# Altium schematic sheet DetectorBoard_V100_DET.SchDoc
size A4; SheetNumber: 1; SheetTotal: 1; Title_: SiPM Detector
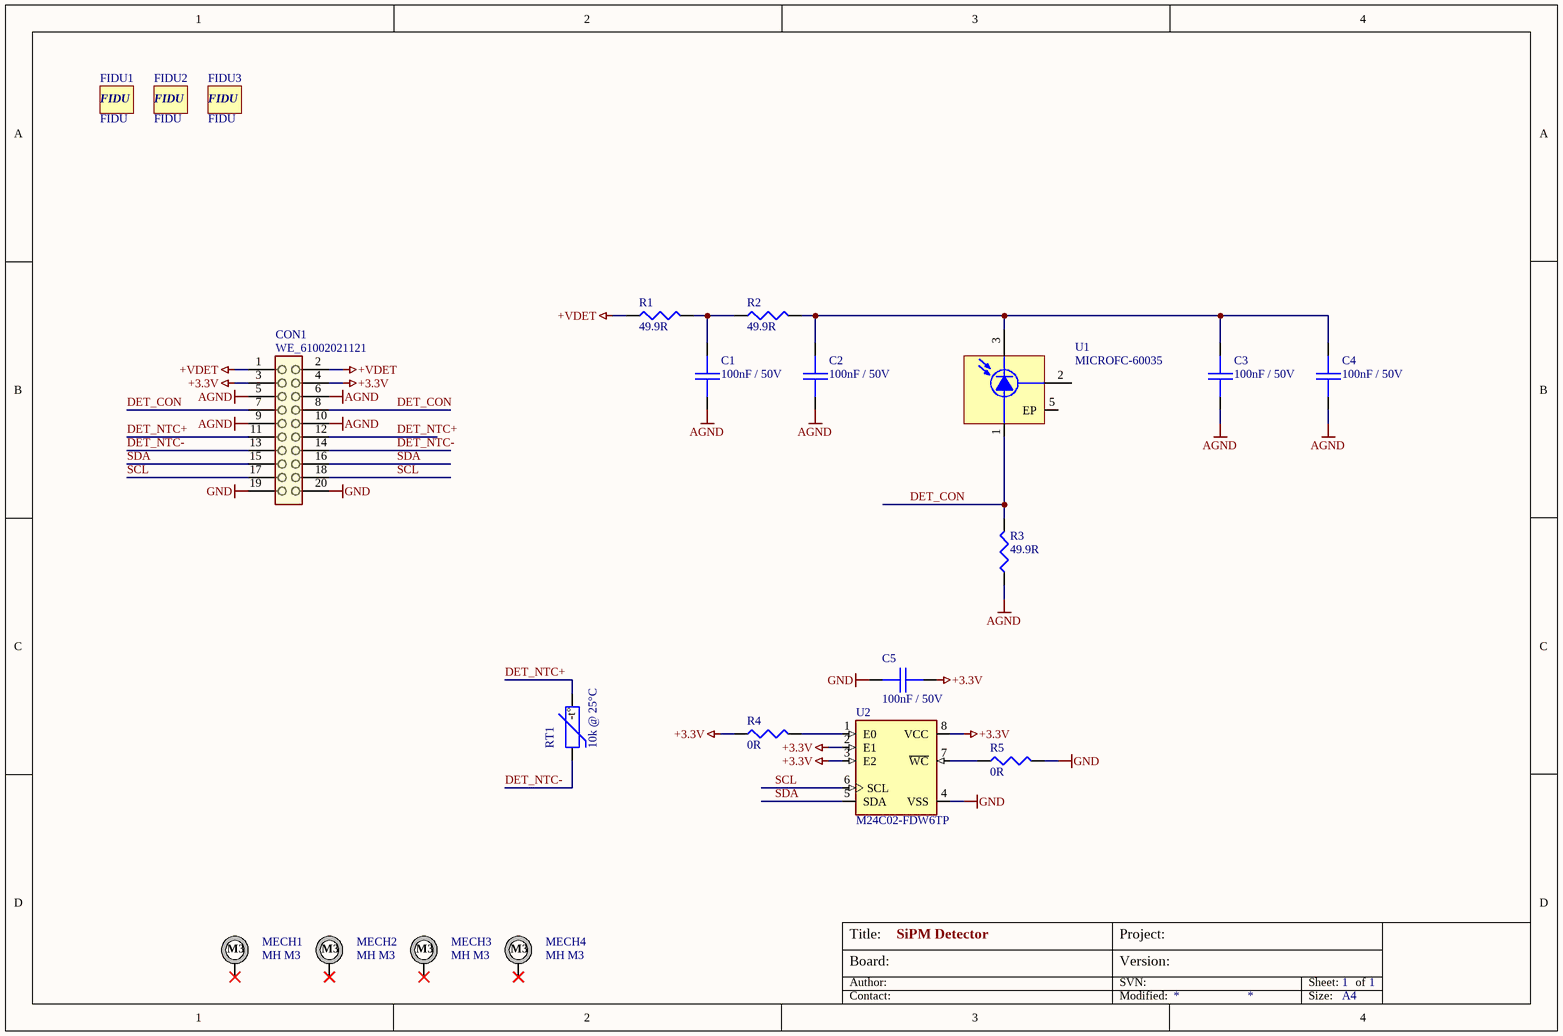
[diagram p0: DetectorBoard_V100_DET.SchDoc]

## Parts
C1  100nF / 50V  [0805_C]
C2  100nF / 50V  [0805_C]
C3  100nF / 50V  [0805_C]
C4  100nF / 50V  [0805_C]
C5  100nF / 50V  [0805_C]
CON1  WE_61002021121  [WE_61002021121]
FIDU1  FIDU  [FIDU_4x4]  (no BOM)
FIDU2  FIDU  [FIDU_4x4]  (no BOM)
FIDU3  FIDU  [FIDU_4x4]  (no BOM)
MECH1  MH M3  [PAD_M3 x 7]  (no BOM)
MECH2  MH M3  [PAD_M3 x 7]  (no BOM)
MECH3  MH M3  [PAD_M3 x 7]  (no BOM)
MECH4  MH M3  [PAD_M3 x 7]  (no BOM)
R1  49.9R  [0805]
R2  49.9R  [0805]
R3  49.9R  [0805]
R4  0R  [0805]
R5  0R  [0805]
RT1  10k @ 25°C  [0805]
U1  MICROFC-60035  [MICROFC-60035-SMT-TR]
U2  M24C02-FDW6TP  [TSSOP-8]

## Nets
+3.3V: C5.2 CON1.3 CON1.4 R4.1 U2.2(E1) U2.3(E2) U2.8(VCC)
+VDET: CON1.1 CON1.2 R1.1
AGND: C1.2 C2.2 C3.2 C4.2 CON1.5 CON1.6 CON1.9 CON1.10 R3.1
GND: C5.1 CON1.19 CON1.20 R5.2 U2.4(VSS)
DET_CON: CON1.7 CON1.8 R3.2 U1.1(P-ANODE)
DET_NTC+: CON1.11 CON1.12 RT1.2
DET_NTC-: CON1.13 CON1.14 RT1.1
SCL: CON1.17 CON1.18 U2.6(SCL)
SDA: CON1.15 CON1.16 U2.5(SDA)
NetC1_1: C1.1 R1.2 R2.1
NetC2_1: C2.1 C3.1 C4.1 R2.2 U1.3(N-CATHODE)
NetR4_2: R4.2 U2.1(E0)
NetR5_1: R5.1 U2.7(~{WC})

Not connected (* = marked no-connect by the designer): MECH1 M3*; MECH2 M3*; MECH3 M3*; MECH4 M3*; U1 2(F-FAST_OUTPUT) 5(EP)

## Notes on the sheet
- Board:
- Author:
- Title:
- Project:
- SVN:
- Version:
- Sheet:
- of
- Contact:
- Modified:
- Size:
- A4
- (in symbol 325) -t°

## Library data of the parts
C1-C5 = 149: 100nF 50V X7R; Part Number: SMD0805-100nF-50V; Azonosító: 149; Category: Passives; Subcategory: PASS_Capacitor; Supplier 1: HESTORE; Supplier 1 order number: 100.011.22
CON1 = 396: Board-To-Board Connector, Vertical, 2.54 mm, 2x10 Contacts, Header, WR-PHD Series, SMD; Azonosító: 396; Part Number: 61002021121; Category: Connectors; Subcategory: ELME_Other; Supplier 1: MOUSER; Supplier 1 order number: 710-61002021121; Help URL: https://www.we-online.com/components/products/datasheet/61002021121.pdf; System: Connector
FIDU1-FIDU3 = 275: FIDU, 4x4mm, rectangle; Azonosító: 275; Part Number: FIDU_4x4; Category: Electro-mechanicals; Subcategory: ELME_Other
MECH1-MECH4 = 268: 3.2/7mm Mounting_Hole_M3; Azonosító: 268; Part Number: Mounting_Hole_M3; Category: Electro-mechanicals; Subcategory: ELME_Other
R1-R3 = 43: 49.9R 0805 0.125W 1%; Part Number: SMD0805-49.9R 1%; Azonosító: 43; Category: Passives; Subcategory: PASS_Resistor; Supplier 1: HESTORE; Supplier 1 order number: 100.317.46
R4 R5 = 38: 0R 0805 0.125W 5%; Part Number: 0 R 5%; Azonosító: 38; Category: Passives; Subcategory: PASS_Resistor; Supplier 1: HESTORE; Supplier 1 order number: 100.275.70
RT1 = 325: NTC (Negative Temperature Coefficient) Thermistors THERMISTOR 0805 10K/3435; Part Number: TX08F103F3435ER; Azonosító: 325; Category: Passives; Subcategory: PASS_Other; Supplier 1: MOUSER; Supplier 1 order number: 588-TX08F103F3435ER
U1 = 394: Silicon Photomultipliers(SiPM), Low-Noise,Blue-Sensitive; Part Number: MICROFC-60035-SMT; MF: ON Semiconductor; Azonosító: 394; Price: None; SnapEDA_Link: https://www.snapeda.com/parts/MICROFC-60035-SMT-TR1/ON%20Semiconductor/view-part/3228590/?ref=snap; Availability: Unavailable; Value: *; MP: MICROFC-60035-SMT-TR1; Package: SMD-4 ON Semiconductor; Category: Optoelectronics; Subcategory: SENS_Optical; Supplier 1: MOUSER; Supplier 1 order number: 863-MFC60035SMTTR; Help URL: https://hu.mouser.com/datasheet/2/308/1/MICROC_SERIES_D-2315622.pdf
U2 = 345: EEPROM Memory IC 2Kb (256 x 8) I2C 400kHz 900ns 8-TSSOP; MF: STMicroelectronics; Azonosító: 345; Package: TSSOP-8 STMicroelectronics; MP: M24C02-FDW6TP; Digi-Key_Part_Number: 497-15746-1-ND; Value: *; SnapEDA_Link: https://www.snapeda.com/parts/M24C02-FDW6TP/STMicroelectronics/view-part/1102461/?ref=snap; Part Number: M24C02-FDW6TP; Category: Integrated Circuits; Subcategory: IC_Memory; Supplier 1: MOUSER; Supplier 1 order number: 511-M24C02-FDW6TP; Help URL: https://www.st.com/resource/en/datasheet/m24c01-w.pdf